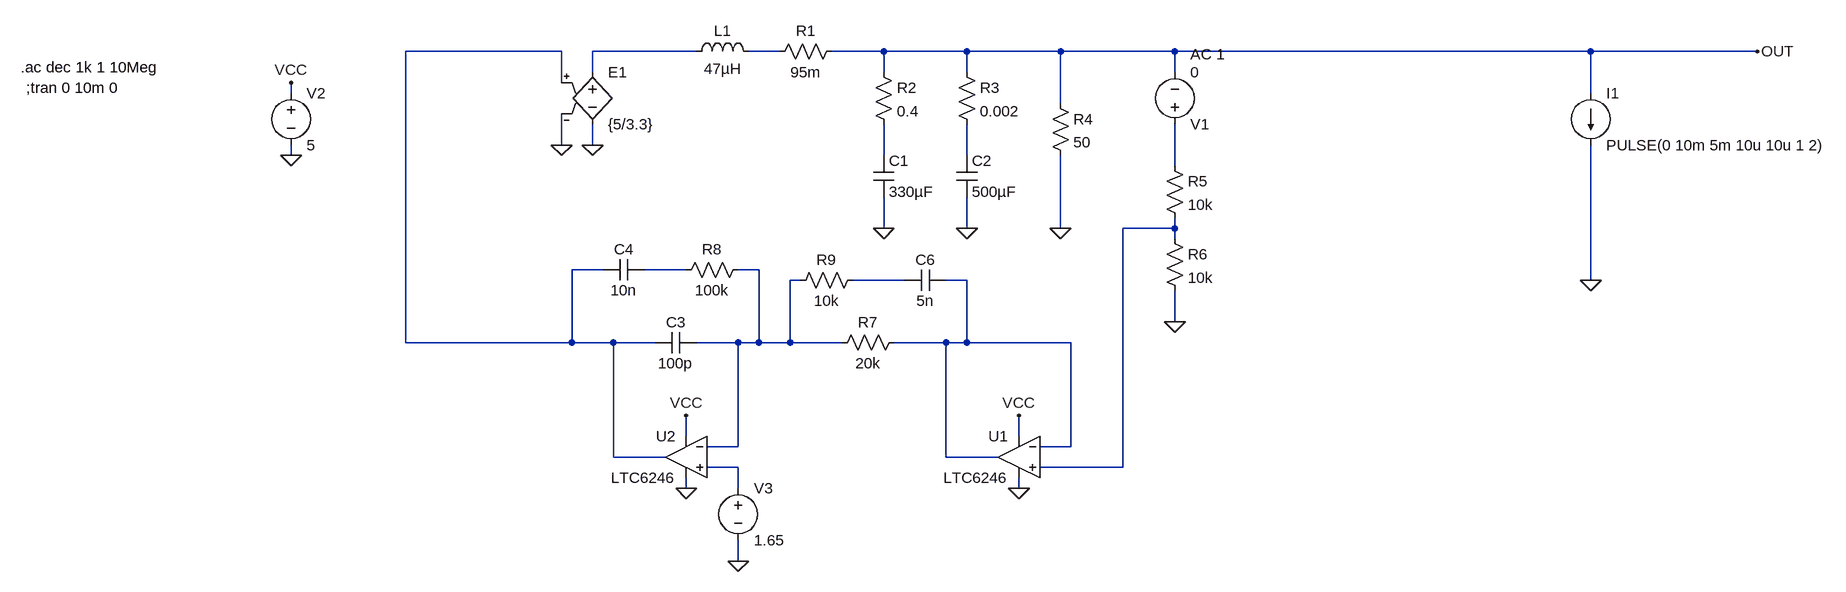
[diagram p0: schematic Digital_Buck_Converter_Type1_Small_Signal_Model.asc]
Digital_Buck_Converter_Type1_Small_Signal_Model.asc, the LTspice schematic file:
Version 4
SHEET 1 2016 1012
WIRE 48 128 -192 128
WIRE 256 128 96 128
WIRE 384 128 336 128
WIRE 544 128 464 128
WIRE 672 128 544 128
WIRE 816 128 672 128
WIRE 992 128 816 128
WIRE 1632 128 992 128
WIRE 1888 128 1632 128
WIRE 96 160 96 128
WIRE 544 160 544 128
WIRE 672 160 672 128
WIRE 992 160 992 128
WIRE 48 176 48 128
WIRE -368 192 -368 176
WIRE 1632 192 1632 128
WIRE 816 208 816 128
WIRE 48 272 48 224
WIRE 96 272 96 240
WIRE -368 288 -368 272
WIRE 544 288 544 240
WIRE 672 288 672 240
WIRE 992 304 992 240
WIRE 544 400 544 352
WIRE 672 400 672 352
WIRE 816 400 816 288
WIRE 992 400 992 384
WIRE 992 400 912 400
WIRE 992 416 992 400
WIRE 112 464 64 464
WIRE 240 464 176 464
WIRE 352 464 320 464
WIRE 416 480 400 480
WIRE 576 480 496 480
WIRE 672 480 640 480
WIRE 1632 480 1632 272
WIRE 992 544 992 496
WIRE -192 576 -192 128
WIRE 64 576 64 464
WIRE 64 576 -192 576
WIRE 128 576 64 576
WIRE 192 576 128 576
WIRE 320 576 256 576
WIRE 352 576 352 464
WIRE 352 576 320 576
WIRE 400 576 400 480
WIRE 400 576 352 576
WIRE 480 576 400 576
WIRE 640 576 560 576
WIRE 672 576 672 480
WIRE 672 576 640 576
WIRE 832 576 672 576
WIRE 240 720 240 688
WIRE 752 720 752 688
WIRE 320 736 320 576
WIRE 320 736 272 736
WIRE 832 736 832 576
WIRE 832 736 784 736
WIRE 128 752 128 576
WIRE 208 752 128 752
WIRE 640 752 640 576
WIRE 720 752 640 752
WIRE 320 768 272 768
WIRE 912 768 912 400
WIRE 912 768 784 768
WIRE 240 800 240 784
WIRE 320 800 320 768
WIRE 752 800 752 784
WIRE 320 912 320 880
FLAG 544 400 0
FLAG 672 400 0
FLAG 816 400 0
FLAG 1888 128 OUT
FLAG 992 544 0
FLAG 96 272 0
FLAG 48 272 0
FLAG 1632 480 0
FLAG -368 288 0
FLAG -368 176 VCC
FLAG 752 800 0
FLAG 752 688 VCC
FLAG 240 800 0
FLAG 240 688 VCC
FLAG 320 912 0
SYMBOL ind 240 144 R270
WINDOW 0 32 56 VTop 2
WINDOW 3 5 56 VBottom 2
SYMATTR InstName L1
SYMATTR Value 47µH
SYMBOL res 480 112 R90
WINDOW 0 0 56 VBottom 2
WINDOW 3 32 56 VTop 2
SYMATTR InstName R1
SYMATTR Value 95m
SYMBOL cap 528 288 R0
SYMATTR InstName C1
SYMATTR Value 330µF
SYMBOL res 528 144 R0
SYMATTR InstName R2
SYMATTR Value 0.4
SYMBOL cap 656 288 R0
SYMATTR InstName C2
SYMATTR Value 500µF
SYMBOL res 656 144 R0
SYMATTR InstName R3
SYMATTR Value 0.002
SYMBOL res 800 192 R0
SYMATTR InstName R4
SYMATTR Value 50
SYMBOL res 976 288 R0
SYMATTR InstName R5
SYMATTR Value 10k
SYMBOL res 976 400 R0
SYMATTR InstName R6
SYMATTR Value 10k
SYMBOL e 96 144 R0
SYMATTR InstName E1
SYMATTR Value {5/3.3}
SYMBOL voltage 992 256 M180
WINDOW 123 24 124 Left 2
WINDOW 39 0 0 Left 0
SYMATTR Value2 AC 1
SYMATTR InstName V1
SYMATTR Value 0
SYMBOL current 1632 192 R0
WINDOW 123 0 0 Left 0
WINDOW 39 0 0 Left 0
SYMATTR InstName I1
SYMATTR Value PULSE(0 10m 5m 10u 10u 1 2)
SYMBOL voltage -368 176 R0
WINDOW 123 0 0 Left 0
WINDOW 39 0 0 Left 0
SYMATTR InstName V2
SYMATTR Value 5
SYMBOL Opamps\\LTC6246 752 752 M0
SYMATTR InstName U1
SYMBOL Opamps\\LTC6246 240 752 M0
SYMATTR InstName U2
SYMBOL voltage 320 784 R0
WINDOW 123 0 0 Left 0
WINDOW 39 0 0 Left 0
SYMATTR InstName V3
SYMATTR Value 1.65
SYMBOL res 576 560 R90
WINDOW 0 0 56 VBottom 2
WINDOW 3 32 56 VTop 2
SYMATTR InstName R7
SYMATTR Value 20k
SYMBOL cap 256 560 R90
WINDOW 0 0 32 VBottom 2
WINDOW 3 32 32 VTop 2
SYMATTR InstName C3
SYMATTR Value 100p
SYMBOL res 336 448 R90
WINDOW 0 0 56 VBottom 2
WINDOW 3 32 56 VTop 2
SYMATTR InstName R8
SYMATTR Value 100k
SYMBOL cap 176 448 R90
WINDOW 0 0 32 VBottom 2
WINDOW 3 32 32 VTop 2
SYMATTR InstName C4
SYMATTR Value 10n
SYMBOL res 512 464 R90
WINDOW 0 0 56 VBottom 2
WINDOW 3 32 56 VTop 2
SYMATTR InstName R9
SYMATTR Value 10k
SYMBOL cap 640 464 R90
WINDOW 0 0 32 VBottom 2
WINDOW 3 32 32 VTop 2
SYMATTR InstName C6
SYMATTR Value 5n
TEXT -784 152 Left 2 !.ac dec 1k 1 10Meg
TEXT -776 184 Left 2 !;tran 0 10m 0

The netlist it stands for:
* Digital_Buck_Converter_Type1_Small_Signal_Model.asc
L1 N002 N003 47µH
R1 OUT N003 95m
C1 N004 0 330µF
R2 OUT N004 0.4
C2 N005 0 500µF
R3 OUT N005 0.002
R4 OUT 0 50
R5 N006 N007 10k
R6 N007 0 10k
E1 N002 0 N001 0 {5/3.3}
V1 N006 OUT 0 AC 1
I1 OUT 0 PULSE(0 10m 5m 10u 10u 1 2)
V2 VCC 0 5
* U1: LTC6246 (symbol Opamps\LTC6246 not available, pins judged from their places): In+=N007 In-=N011 V+=VCC V-=0 OUT=N011
* U2: LTC6246 (symbol Opamps\LTC6246 not available, pins judged from their places): In+=N012 In-=N009 V+=VCC V-=0 OUT=N001
V3 N012 0 1.65
R7 N011 N009 20k
C3 N009 N001 100p
R8 N009 N008 100k
C4 N008 N001 10n
R9 N010 N009 10k
C6 N011 N010 5n
.ac dec 1k 1 10Meg
;tran 0 10m 0
.backanno
.end